# EAGLE design SMPS_2018_09_04_A (EAGLE 7.4.0)
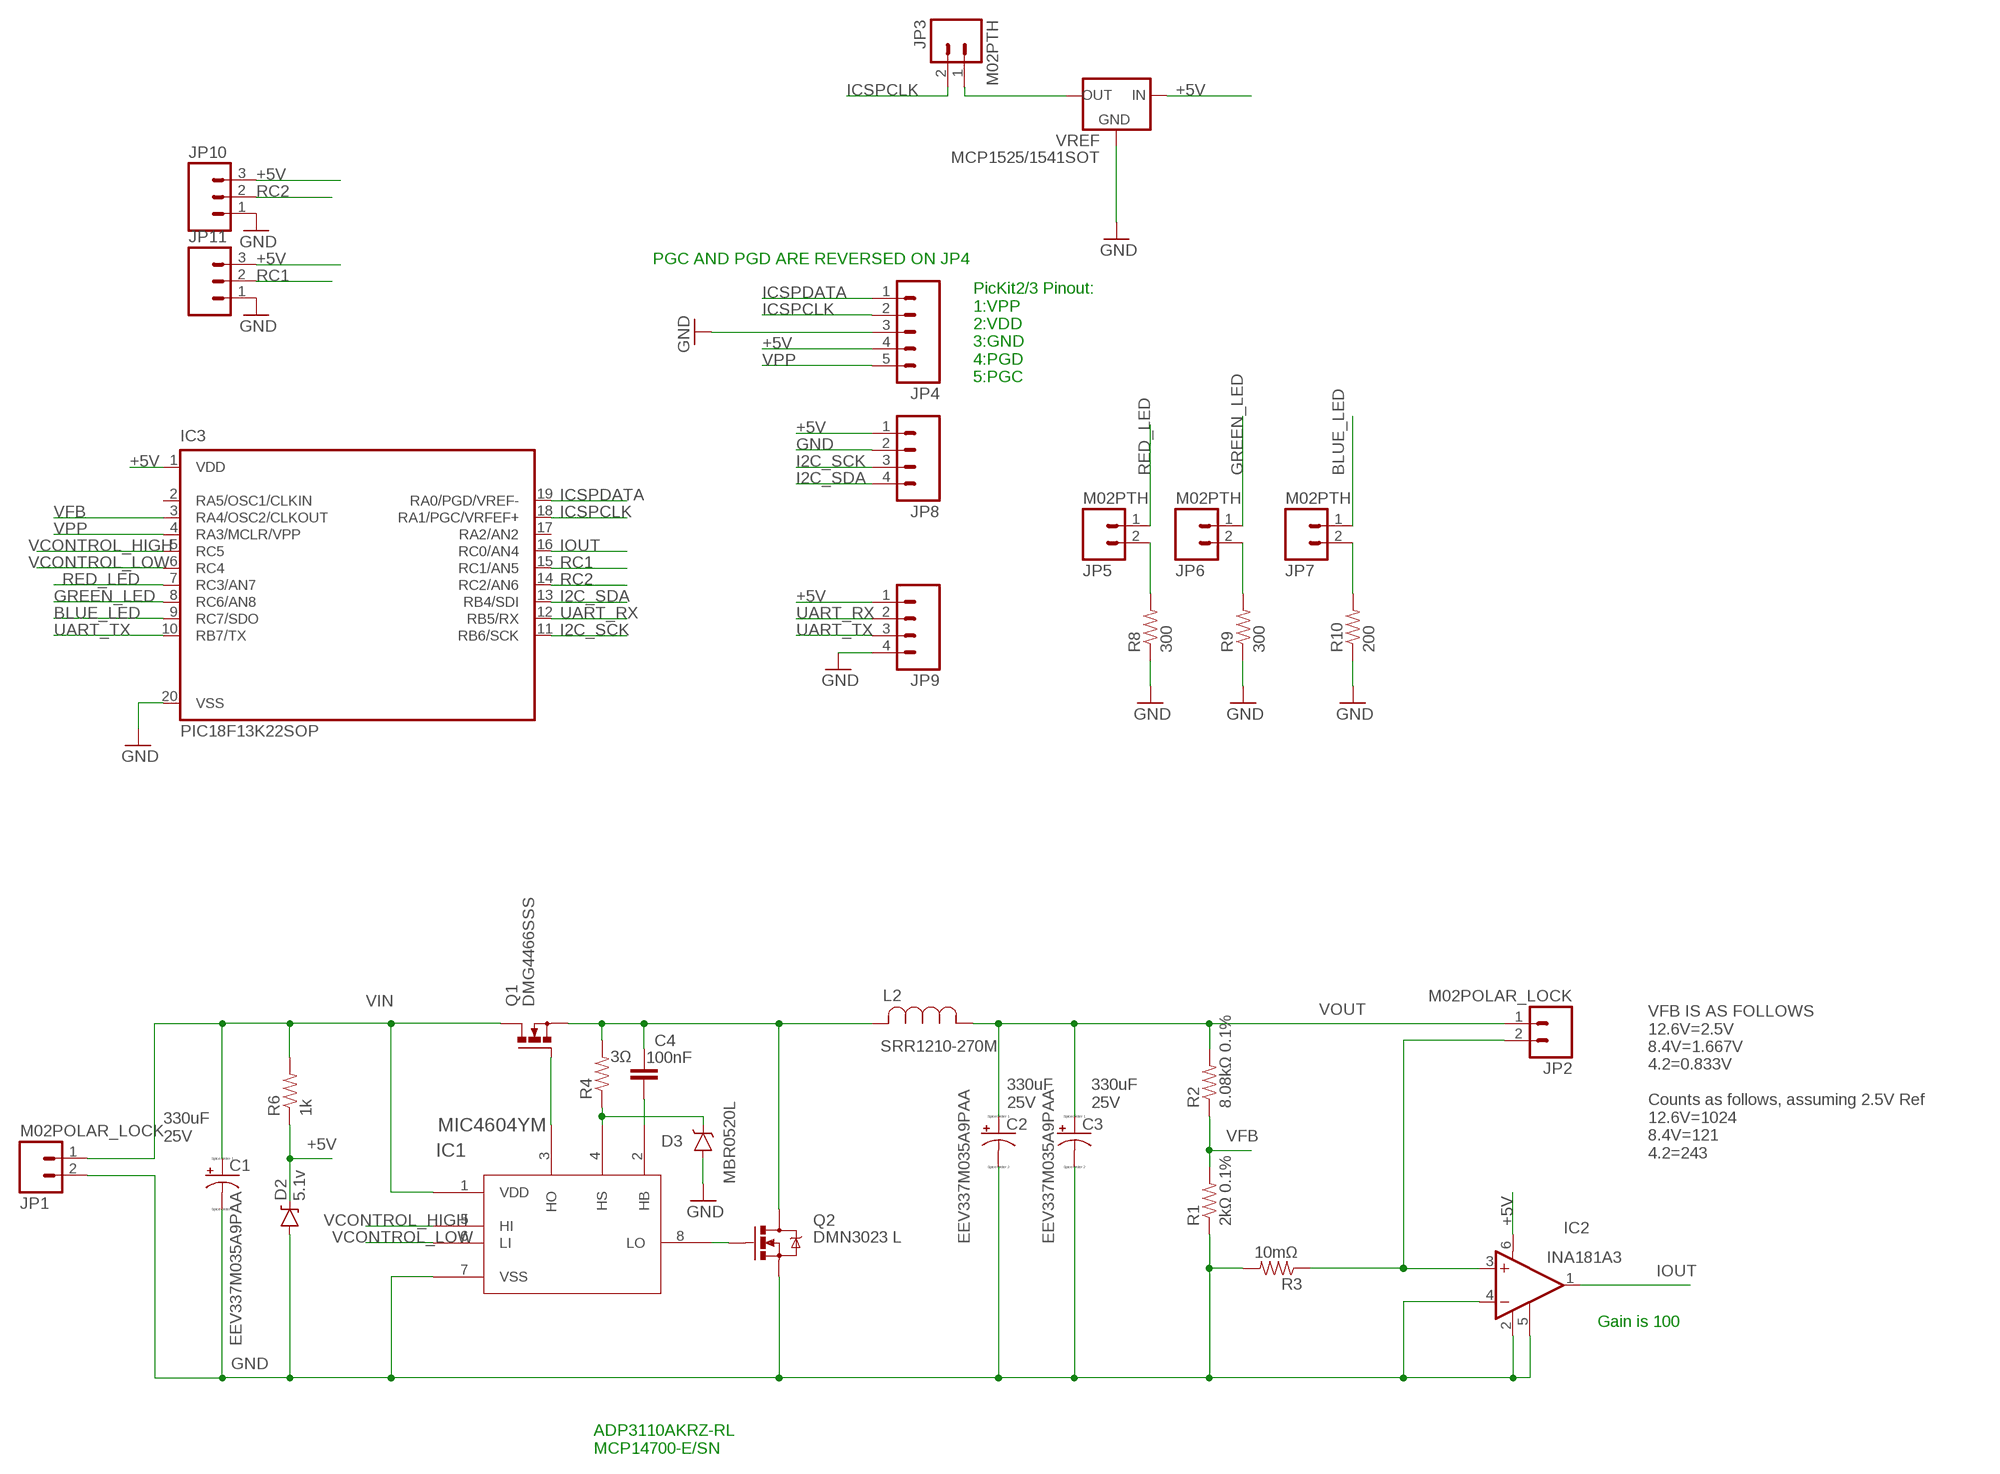
[diagram p0: schematic, sheet 1]

## Parts
C1  EEV337M035A9PAA  CPOL-US140CLH-1010  [140CLH-1010]
C2  EEV337M035A9PAA  CPOL-US140CLH-1010  [140CLH-1010]
C3  EEV337M035A9PAA  CPOL-US140CLH-1010  [140CLH-1010]
C4  100nF  CAP1206  [1206]
D2  5.1v  DIODE-ZENERSMB  [SMB-DIODE]
D3  MBR0520L  DIODE-SCHOTTKY-B340A  [SMA-DIODE]
IC1  MIC4604YM  [SOIC-8_M]
IC2  INA181A3  [SOT23-6]
IC3  PIC18F13K22SOP  [SOP20W]
JP1  M02POLAR_LOCK  [MOLEX-1X2_LOCK]
JP2  M02POLAR_LOCK  [MOLEX-1X2_LOCK]
JP3  M02PTH  [1X02]
JP4  M05PTH_LONGPADS  [1X05_LONGPADS]
JP5  M02PTH  [1X02]
JP6  M02PTH  [1X02]
JP7  M02PTH  [1X02]
JP8  M04LOCK  [1X04_LOCK]
JP9  M04LOCK  [1X04_LOCK]
JP10  M03LOCK  [1X03_LOCK]
JP11  M03LOCK  [1X03_LOCK]
L2  SRR1210-270M  SRR1210-680M  [IND_BOURNS_SRR1210]
Q1  DMG4466SSS  N-MOSFET-SO8S  [SO-08]
Q2  DMN3023 L  MOSFET-NCHANNELBSS123LT1G  [SOT23-3]
R1  2kΩ 0.1%  RESISTOR1206  [1206]
R2  8.08kΩ 0.1%  RESISTOR1206  [1206]
R3  10mΩ  RESISTOR1206  [1206]
R4  3Ω  RESISTOR1206  [1206]
R6  1k  RESISTOR1206  [1206]
R8  300  RESISTOR1206  [1206]
R9  300  RESISTOR1206  [1206]
R10  200  RESISTOR1206  [1206]
VREF  MCP1525/1541SOT  [SOT23-3]

## Nets
+5V: D2.C IC2.6(V+) IC3.1(VDD) JP4.4 JP8.1 JP9.1 JP10.3 JP11.3 R6.1 VREF.1(IN)
BLUE_LED: IC3.9(RC7/SDO) JP7.1
BORKED: IC2.3(+IN) JP2.2 R3.1
GND: C1.- C2.- C3.- D2.A D3.A IC1.7(VSS) IC2.2(GND) IC2.4(-IN) IC2.5(REF) IC3.20(VSS) JP1.2 JP4.3 JP8.2 JP9.4 JP10.1 JP11.1 Q2.2(S) R1.1 R3.2 R8.1 R9.1 R10.1 VREF.3(GND)
GREEN_LED: IC3.8(RC6/AN8) JP6.1
HIGHDRIVE: IC1.3(HO) Q1.4(G)
I2C_SCK: IC3.11(RB6/SCK) JP8.3
I2C_SDA: IC3.13(RB4/SDI) JP8.4
ICSPCLK: IC3.18(RA1/PGC/VRFEF+) JP3.2 JP4.2
ICSPDATA: IC3.19(RA0/PGD/VREF-) JP4.1
IOUT: IC2.1(OUT) IC3.16(RC0/AN4)
N$2: C4.2 L2.2 Q1.1(S) Q1.2(S) Q1.3(S) Q2.3(D) R4.2
N$3: JP5.2 R8.2
N$4: C4.1 IC1.2(HB)
N$5: IC1.8(LO) Q2.1(G)
N$6: JP6.2 R9.2
N$7: JP7.2 R10.2
N$8: D3.C IC1.4(HS) R4.1
RC1: IC3.15(RC1/AN5) JP11.2
RC2: IC3.14(RC2/AN6) JP10.2
RED_LED: IC3.7(RC3/AN7) JP5.1
UART_RX: IC3.12(RB5/RX) JP9.2
UART_TX: IC3.10(RB7/TX) JP9.3
VCONTROL_HIGH: IC1.5(HI) IC3.5(RC5)
VCONTROL_LOW: IC1.6(LI) IC3.6(RC4)
VFB: IC3.3(RA4/OSC2/CLKOUT) R1.2 R2.1
VIN: C1.+ IC1.1(VDD) JP1.1 Q1.5(D) Q1.6(D) Q1.7(D) Q1.8(D) R6.2
VOUT: C2.+ C3.+ JP2.1 L2.1 R2.2
VPP: IC3.4(RA3/MCLR/VPP) JP4.5
VREF+: JP3.1 VREF.2(OUT)
Unconnected: IC3.2(RA5/OSC1/CLKIN) IC3.17(RA2/AN2)

## Notes on the sheet
- PGC AND PGD ARE REVERSED ON JP4
- PicKit2/3 Pinout:
  1:VPP
  2:VDD
  3:GND
  4:PGD
  5:PGC
- 330uF
  25V
- 330uF
  25V
- 330uF
  25V
- VFB IS AS FOLLOWS
  12.6V=2.5V
  8.4V=1.667V
  4.2=0.833V
  
  Counts as follows, assuming 2.5V Ref
  12.6V=1024
  8.4V=121
  4.2=243
- Gain is 100
- ADP3110AKRZ-RL 
  MCP14700-E/SN

## Library data of the parts
C1-C3 = resistor:CPOL-US: POLARIZED CAPACITOR, American symbol
C4 = SparkFun-Capacitors:CAP: Capacitor Standard 0603 ceramic capacitor, and 0.1" leaded capacitor.
D2 = SparkFun-DiscreteSemi:DIODE-ZENER: Zener Diode Production Part - 8199 3.4V Zener Voltage
D3 = SparkFun-DiscreteSemi:DIODE-SCHOTTKY: Schottky diodes in SFE's production catalog BAT20J 1A 23V 0.62Vf RB751 120mA 40V 0.37Vf PMEG4005EJ 0.5A 40V 0.42Vf MBRA140 1A 40V 0.5Vf B340A 3A 40V SMA; PROD_ID: DIO-09886; VALUE: B340A
IC1 = MIC4604YM:MIC4604YM; MANUFACTURER_PART_NUMBER: mic4604ym; VENDOR: Microchip
IC2 = INA181A3:INA181A3
IC3 = PIC18F13k22:PIC18F13K22?: 18/20/28-Pin High-Performance, Enhanced Flash Microcontrollers with 10-bit A/D and nanoWatt Technology Source: ww1.microchip.com/downloads/en/DeviceDoc/39605c.pdf
JP1-JP3 JP5-JP7 = SparkFun-Connectors:M02: Standard 2-pin 0.1" header. Use with - straight break away headers ( PRT-00116) - right angle break away headers (PRT-00553) - swiss pins (PRT-00743) - machine pins (PRT-00117) - female headers (PRT-00115) Molex polarized connector foot print use with: PRT-08233 with associated crimp pins and housings. 2.54_SCREWTERM for use with PRT-10571. 3.5mm Screw Terminal footprints for PRT-08084 5mm Screw Terminal footprints for use with PRT-08432
JP4 = SparkFun-Connectors:M05: Header 5 Standard 5-pin 0.1" header. Use with straight break away headers (SKU : PRT-00116), right angle break away headers (PRT-00553), swiss pins (PRT-00743), machine pins (PRT-00117), and female headers (PRT-00115). Molex polarized connector foot print use with SKU : PRT-08230 with associated crimp pins and housings.
JP8 JP9 = SparkFun-Connectors:M04: Header 4 Standard 4-pin 0.1" header. Use with straight break away headers (SKU : PRT-00116), right angle break away headers (PRT-00553), swiss pins (PRT-00743), machine pins (PRT-00117), and female headers (PRT-00115). Molex polarized connector foot print use with SKU : PRT-08231 with associated crimp pins and housings. 1MM SMD Version SKU: PRT-10208
JP10 JP11 = SparkFun-Connectors:M03: Header 3 Standard 3-pin 0.1" header. Use with straight break away headers (SKU : PRT-00116), right angle break away headers (PRT-00553), swiss pins (PRT-00743), machine pins (PRT-00117), and female headers (PRT-00115). Molex polarized connector foot print use with SKU : PRT-08232 with associated crimp pins and housings.
L2 = SRR1210_XXX:SRR1210-680M; MANUFACTURER_PART_NUMBER: SRR1210680M; VENDOR: Bourns Electronics
Q1 = transistor-power:N-MOSFET-SO8: N-Channel MOSFET Example: FDS7760A; N-Channel Logic Level PowerTrench® MOSFET FDS2572; N-Channel UltraFET® Trench MOSFET Source: www.fairchildsemi.com
Q2 = SparkFun-DiscreteSemi:MOSFET-NCHANNEL: Common NMOSFET Parts MFG P/N Store ID Prod ID FDD8780 TRANS-09984 SI7820DN TRANS-11055 FDS6630A IC-08089 2N7002PW TRANS-11151 FQP30N06L COM-10213 TRANS-10060 BSS123LT1G TRANS-08345 BSS138 TRANS-00830 BS170 2N7000; PROD_ID: TRANS-08345
R1-R4 R6 R8-R10 = SparkFun-Passives:RESISTOR: Resistor Basic schematic elements and footprints for 0603, 1206, and PTH resistors.
VREF = MCP1525:MCP1525/1541

## Board
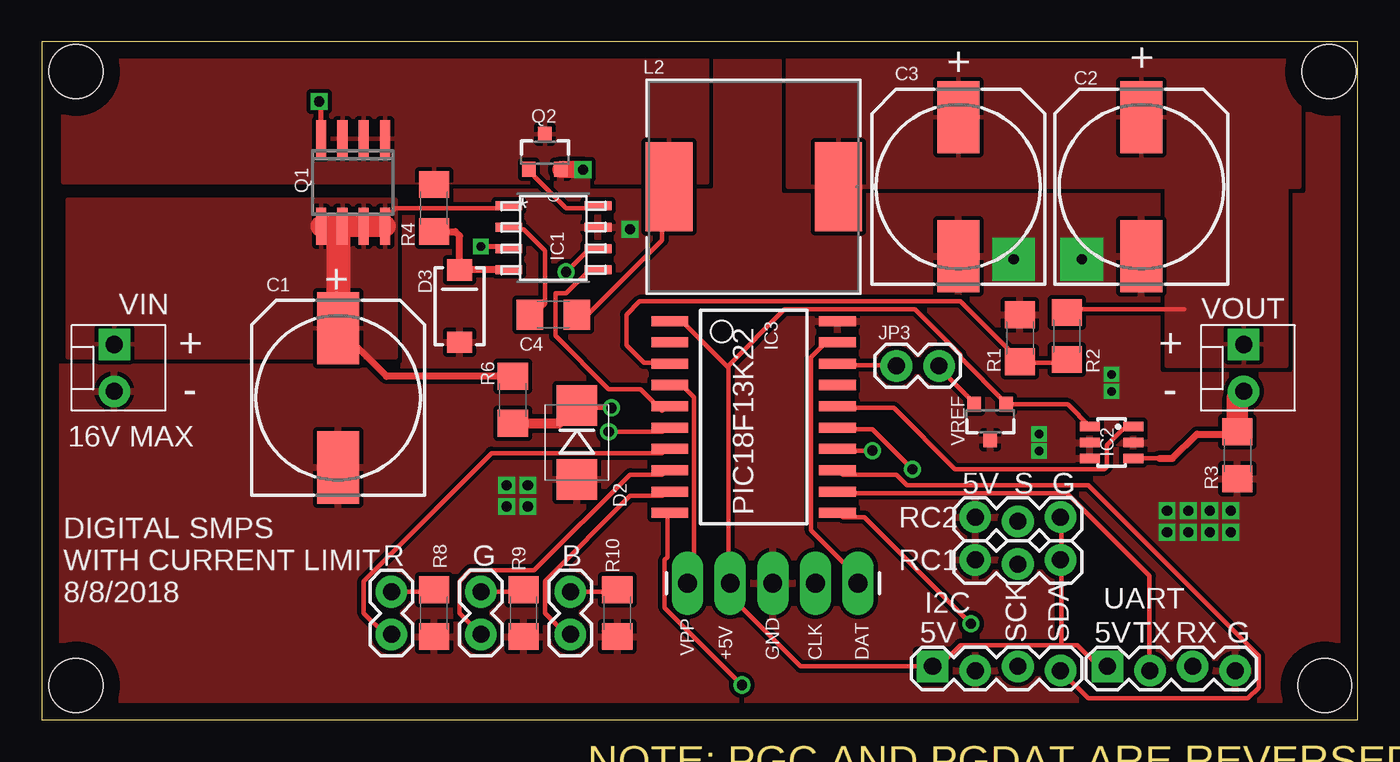
[diagram p1: board, top side]
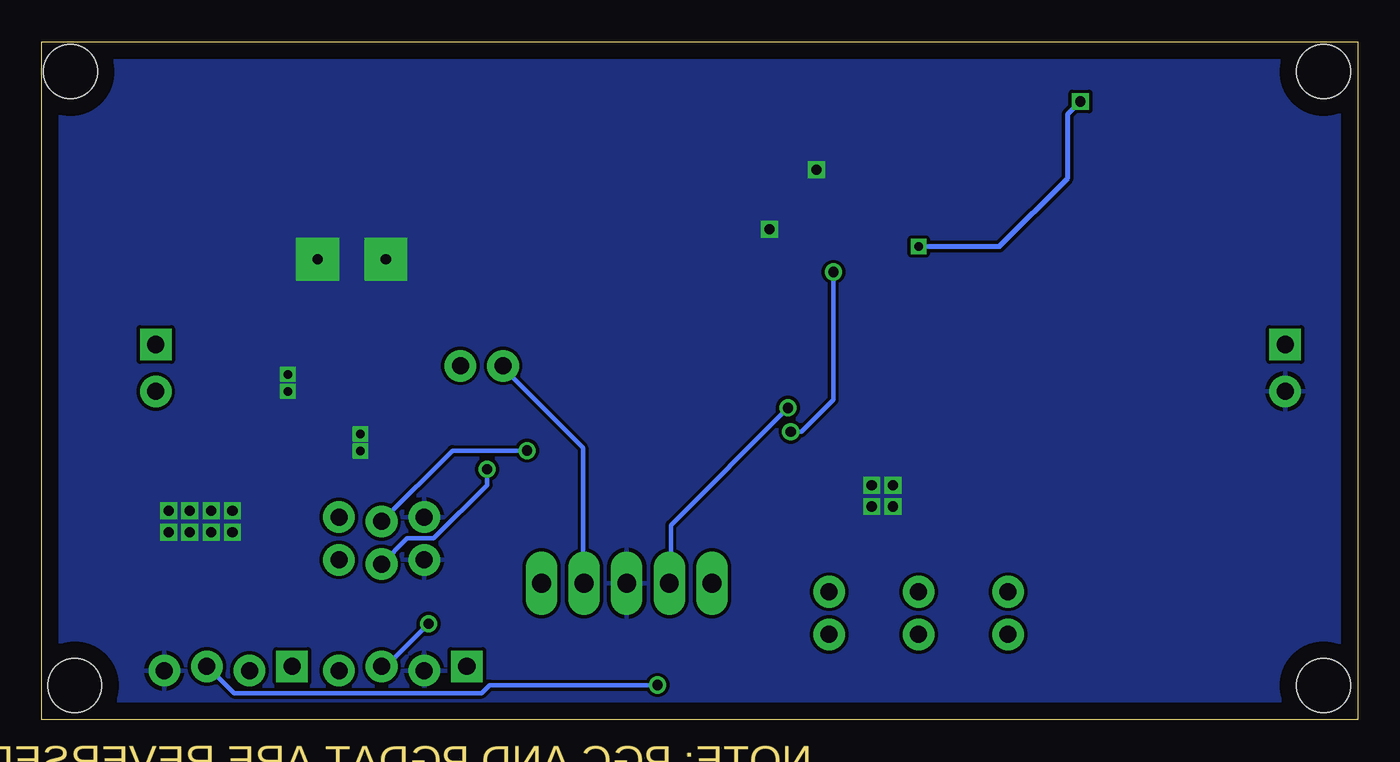
[diagram p2: board, bottom side, seen from below]

Size 78.41 x 40.38 mm. Coordinates in mm from the lower left corner, seen from the top.
Outline: 0,0 78.41,0 78.41,40.38 0,40.38 0,0
Copper layers (1*16): Top 0.035mm / dielectric 1.5mm / Bottom 0.035mm
Design rules "default": minimum track width 10mil, minimum drill 24mil, track to track 8mil, track to pad 8mil, pad to pad 8mil, via to via 8mil, smd to smd 8mil, copper to edge 40mil, drill to drill 8mil, minimum pad ring 10mil, minimum via ring 8mil, stop-mask expansion 4mil, vias tented up to drill 0mil, thermal gap 10mil
Holes 3.2 mm at 2.03,38.61 2.03,2.03 76.45,2.03 76.71,38.61

### Footprints (pad centres in the part's own frame; a part is rotated, then mirrored left to right if it is on the bottom)
140CLH-1010 = smd 4.3 x 2.5: + 4.15,0; - -4.15,0
1206 = smd 1.6 x 1.8: 1 -1.4,0; 2 1.4,0
SMB-DIODE = smd 2.4 x 2.4: A 2.2,0; C -2.2,0
SMA-DIODE = smd 1.27 x 1.47: A -2.15,0; C 2.15,0
SOIC-8_M = smd 1.6 x 0.533: 1 -2.654,1.905; 2 -2.654,0.635; 3 -2.654,-0.635; 4 -2.654,-1.905; 5 2.654,-1.905; 6 2.654,-0.635; 7 2.654,0.635; 8 2.654,1.905
SOT23-6 = smd 0.55 x 1.2: 1 0.95,-1.3; 2 0,-1.3; 3 -0.95,-1.3; 4 -0.95,1.3; 5 0,1.3; 6 0.95,1.3
SOP20W = smd 0.6 x 2.2: 1 -5.715,-5; 2 -4.445,-5; 3 -3.175,-5; 4 -1.905,-5; 5 -0.635,-5; 6 0.635,-5; 7 1.905,-5; 8 3.175,-5; 9 4.445,-5; 10 5.715,-5; 11 5.715,5; 12 4.445,5; 13 3.175,5; 14 1.905,5; 15 0.635,5; 16 -0.635,5; 17 -1.905,5; 18 -3.175,5; 19 -4.445,5; 20 -5.715,5
MOLEX-1X2_LOCK = drill 1.016 pad 1.88 square: 1 -0.127,0 | drill 1.016 pad 1.88: 2 2.667,0
1X02 = drill 1.016 pad 1.88: 1 0,0; 2 2.54,0
1X05_LONGPADS = drill 1.118 pad 1.88 long: 1 0,0; 2 2.54,0; 3 5.08,0; 4 7.62,0; 5 10.16,0
1X04_LOCK = drill 1.016 pad 1.88 square: 1 0,0.127 | drill 1.016 pad 1.88: 2 2.54,-0.127; 3 5.08,0.127; 4 7.62,-0.127
1X03_LOCK = drill 1.016 pad 1.88: 1 0,0.127; 2 2.54,-0.127; 3 5.08,0.127
IND_BOURNS_SRR1210 = smd 2.794 x 5.309: 1 -5.042,0; 2 5.042,0
SO-08 = smd 0.6 x 2.2: 1 -1.905,-2.6; 2 -0.635,-2.6; 3 0.635,-2.6; 4 1.905,-2.6; 5 1.905,2.6; 6 0.635,2.6; 7 -0.635,2.6; 8 -1.905,2.6
SOT23-3 = smd 0.8 x 0.9: 1 -0.95,-1; 2 0.95,-1; 3 0,1.1

### Placement (x,y rotation side)
C1  17.65,19.18 90 top
C2  65.53,31.75 90 top
C3  54.61,31.75 90 top
C4  30.48,24.13 0 top
D2  31.88,16.51 270 top
D3  24.89,24.64 90 top
IC1  30.48,28.7 0 top
IC2  63.75,16.51 90 top
IC3  42.42,18.03 270 top
JP1  4.32,22.23 270 top
JP2  71.63,22.23 270 top
JP3  53.47,21.08 180 top
JP4  48.64,8.13 180 top
JP5  20.83,5.08 90 top
JP6  26.16,5.08 90 top
JP7  31.5,5.08 90 top
JP8  53.09,3.05 0 top
JP9  63.5,3.05 0 top
JP10  55.63,11.94 0 top
JP11  55.63,9.4 0 top
L2  42.42,31.75 180 top
Q1  18.54,32 180 top
Q2  29.97,33.78 0 top
R1  58.29,22.73 270 top
R2  61.09,22.86 90 top
R3  71.25,15.75 270 top
R4  23.37,30.48 90 top
R6  28.07,19.05 90 top
R8  23.37,6.35 90 top
R9  28.7,6.35 90 top
R10  34.29,6.35 90 top
VREF  56.52,17.78 180 top

### Tracks (layer width: path | path; a pad name or v marks a point on that pad's centre or on a via)
+5V  (via drill 0.61)
  Top 0.254: IC2.6 61.13,18.78 VREF.1 57.44,18.89 54.74,21.59 54.74,21.75 52.04,24.45 44.26,24.45 40.85,21.03 | 40.85,21.03 40.93,20.95 40.93,8.26 JP4.4 40.77,7.62 45.21,3.17 JP8.1 53.47,3.17 54.74,4.44 60.77,4.44 | 40.85,21.03 38.23,23.65 37.43,23.65 IC3.1 | v33.94,18.57 32.04,18.57 D2.C | 60.77,4.44 61.72,4.44 62.99,3.17 JP9.1 | 60.77,9.53 60.77,12.06 JP10.3 | 60.77,4.44 60.77,9.53 | 60.77,9.53 JP11.3
  Top 0.61: R6.1 30.82,17.65 D2.C
  Bottom 0.254: v33.94,18.57 40.93,11.59 40.93,8.26 JP4.4
BLUE_LED
  Top 0.254: IC3.9 36.96,13.33 35.05,13.33 29.97,8.26 29.97,6.35 31.24,5.08 JP7.1
BORKED
  Top 0.254: IC2.3 66.61,15.56
  Top 0.406: 66.61,15.56 67.38,15.56 68.83,17.02 71.12,17.02 R3.1
  Top 1.27: R3.1 71.25,19.17 JP2.2
GND  (via drill 0.5, 0.6, 0.6 pad 2.54)
  Top 0.254: IC2.4 62.36,15.56 | 62.36,16.51 IC2.5 62.36,16.51
  Top 1.016: Q2.2 32.24,32.78 v32.26,32.77
  other vias: 27.69,13.97 28.96,13.97 27.69,12.7 28.96,12.7 35.05,29.21 57.91,27.43 61.98,27.43 59.44,17.02 59.44,16 63.75,19.56 63.75,20.57 67.06,12.45 67.06,11.18 68.33,11.18 68.33,12.45 69.6,12.45 69.6,11.18 70.87,11.18 70.87,12.45
  pour Top (isolate 0.254, rank 2): 0.25,39.12 80.77,39.37 80.77,-1.27 0.25,-1.52
  pour Bottom: 12.95,39.88 78.49,39.62 78.49,-3.3 -2.79,-2.79 -2.79,40.13
GREEN_LED
  Top 0.254: JP6.1 24.89,6.35 24.89,8.26 25.53,8.89 29.34,8.89 35.05,14.6 36.96,14.6 IC3.8
HIGHDRIVE  (via drill 0.5, 0.6)
  Top 0.305: v26.16,28.19 27.7,28.19 IC1.3 | Q1.4 16.64,36.7 v16.51,36.83
  Bottom 0.305: v26.16,28.19 21.34,28.19 17.27,32.26 17.27,36.07 v16.51,36.83
I2C_SCK  (via drill 0.61)
  Top 0.254: v55.37,5.71 49.02,12.06 47.75,12.06 IC3.11
  Bottom 0.254: v55.37,5.71 57.91,3.17 JP8.3
I2C_SDA
  Top 0.254: JP8.4 62.36,1.27 71.88,1.27 72.52,1.9 72.52,3.81 62.36,13.97 51.56,13.97 50.93,14.6 47.75,14.6 IC3.13
ICSPCLK
  Top 0.254: IC3.18 47.43,21.11 50.93,21.11 JP3.2
  Bottom 0.254: JP4.2 46.17,8.26 46.17,16.19 50.93,20.95 JP3.2
ICSPDATA
  Top 0.254: IC3.19 47.28,22.38 46.64,22.38 45.85,21.59 45.85,11.27 48.55,8.57 48.55,8.26 JP4.1
IOUT
  Top 0.254: IC2.1 64.9,17.3 64.42,17.3 63.47,16.35 63.47,15.08 63.31,14.92 54.42,14.92 50.77,18.57 47.43,18.57 IC3.16
N$2
  Top 0.254: C4.2 32.51,24.13 36.96,28.57 36.96,31.11 L2.2
  Top 1.422: 37.11,32.01 L2.2
  pour Top (isolate 0.254): 1.27,41.15 39.62,41.15 39.62,32 1.27,32
N$3
  Top 0.254: JP5.2 23.24,7.62 R8.2
N$4
  Top 0.254: IC1.2 28.07,29.21 28.7,29.21 29.97,27.94 29.97,24.77 29.34,24.13 C4.1
N$5
  Top 0.254: Q2.1 29.34,32.38 31.24,30.48 32.51,30.48 IC1.8
N$6
  Top 0.254: 28.58,7.87 R9.2 28.57,7.62 JP6.2
N$7
  Top 0.254: JP7.2 34.16,7.62 R10.2
N$8
  Top 0.406: IC1.4 D3.C 24.89,28.83 24.64,29.08 R4.1
RC1  (via drill 0.61)
  Top 0.254: v51.88,14.92 49.5,17.3 47.43,17.3 IC3.15
  Bottom 0.254: v51.88,14.92 51.88,13.97 55.05,10.79 56.64,10.79 JP11.2
RC2  (via drill 0.61)
  Top 0.254: v49.5,16.03 47.43,16.03 IC3.14
  Bottom 0.254: v49.5,16.03 53.94,16.03 JP10.2
RED_LED
  Top 0.254: IC3.7 36.96,15.87 26.8,15.87 19.18,8.26 19.18,6.35 20.45,5.08 JP5.1
UART_RX
  Top 0.254: IC3.12 47.43,13.49 61.09,13.49 66.01,8.57 66.01,3.02 JP9.2
UART_TX  (via drill 0.61)
  Top 0.254: v41.72,2.06 37.12,6.67 37.12,9.53 37.28,9.68 37.28,12.22 IC3.10
  Bottom 0.254: v41.72,2.06 51.72,2.06 52.2,1.59 66.96,1.59 68.55,3.17 JP9.3
VCONTROL_HIGH
  Top 0.254: IC1.5 32.51,26.67 31.24,25.4 30.61,25.4 30.61,22.86 33.78,19.68 35.69,19.68 36.96,18.41 IC3.5
VCONTROL_LOW  (via drill 0.61)
  Top 0.254: v31.24,26.67 32.51,27.94 IC1.6 | v33.78,17.14 36.96,17.14 IC3.6
  Bottom 0.254: v31.24,26.67 31.24,19.05 33.15,17.14 v33.78,17.14
VFB
  Top 0.254: 60.96,21.34 R2.1 60.93,21.27 58.39,21.27 R1.2 58.23,21.43 54.74,24.92 35.62,24.92 34.83,24.13 34.83,22.32 35.88,21.27 37.28,21.27 IC3.3
VIN
  Top 0.254: IC1.1 27.43,30.48 21.08,30.48 20.45,29.84 Q1.8
  Top 0.406: R6.2 20.53,20.45 C1.+
  Top 1.27: Q1.5 Q1.6 Q1.7 Q1.8
  Top 1.422: Q1.6 17.65,29.4 C1.+
  pour Top (isolate 0.635): 1.52,21.59 21.08,21.59 21.08,30.99 1.52,30.99
VOUT
  Top 0.254: 68.07,24.45 61.09,24.45 R2.2
  Top 1.422: C2.+ 65.16,34.66
  pour Top (isolate 0.254): 44.45,41.66 74.93,41.66 74.93,31.75 44.45,31.75
  pour Top (isolate 0.254): 74.17,32.77 67.06,32.77 67.06,21.08 74.17,21.08
VPP
  Top 0.254: IC3.4 37.43,19.84 38.23,19.84 38.86,19.21 38.86,8.57 38.55,8.26 JP4.5
VREF+
  Top 0.254: VREF.2 55.53,18.89 53.47,20.95 JP3.1

### Text on the board
Dimension: NOTE: PGC AND PGDAT ARE REVERSED
tNames: + | + | + | VIN | VOUT | + | + | - | - | 16V MAX | 5V | S | G | PIC18F13K22 | RC2 | R | G | B | RC1 | I2C | UART | DIGITAL SMPS / WITH CURRENT LIMIT / 8/8/2018 | 5V | SCK | SDA | 5V | TX | RX | G | VPP | +5V | GND | CLK | DAT